# Altium schematic sheet fireAlarm.SchDoc
size 420 x 297 mm; SheetNumber: 1; SheetTotal: 1; DocumentName: Sheet1.SCHDOC
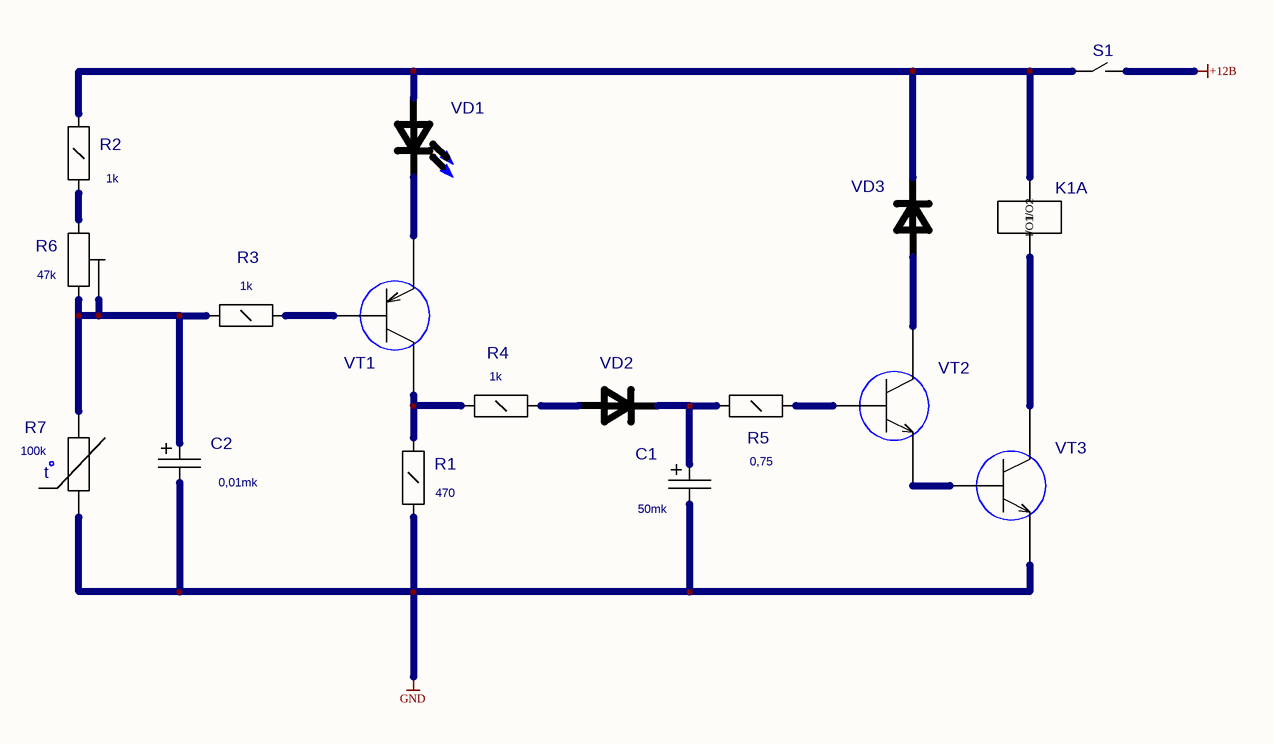
[diagram p0: fireAlarm.SchDoc]

## Parts
C1  value 50mk  [CE6032_C]  (hidden comment: CE6032-C)
C2  value 0,01mk  [CE6032_C]  (hidden comment: CE6032-C)
K1  РЭС-64  [RES64]  (value not drawn)  (part A of 2)
R1  value 470  [C2-33H-0.25W]  (hidden comment: C2-33H-0.25W_OLD_UGO)
R2  value 1k  [C2-33H-0.25W]  (hidden comment: C2-33H-0.25W_OLD_UGO)
R3  value 1k  [C2-33H-0.25W]  (hidden comment: C2-33H-0.25W_OLD_UGO)
R4  value 1k  [C2-33H-0.25W]  (hidden comment: C2-33H-0.25W_OLD_UGO)
R5  value 0,75  [C2-33H-0.25W]  (hidden comment: C2-33H-0.25W_OLD_UGO)
R6  value 47k  [3006P]  (hidden comment: 3006W)
R7  value 100k  [PTC-3]  (hidden comment: PTC-3)
S1  8AS9M2RE  [8AS9M2RE]  (value not drawn)
VD1  АЛ307КМ  [LED-5MM]  (value not drawn)
VD2  КД522А  [КД521(522)]  (value not drawn)
VD3  КД503А  [КД503А]  (value not drawn)
VT1  КТ3107Е  [TO-92-4]  (value not drawn)
VT2  КТ312  [КТ312]  (value not drawn)
VT3  КТ608Б  [КТ605]  (value not drawn)

## Nets
+12B: S1.1
GND: C1.2 C2.2 R1.1 R7.1 VT3.2(E)
NetC1_1: C1.1 R5.2 VD2.2(K)
NetC2_1: C2.1 R3.2 R6.2 R6.3 R7.2
NetK1_1: K1.1(I/O1) VT3.3(K)
NetK1_2: K1.2(I/O2) R2.2 S1.2 VD1.1(A) VD3.K
NetR1_2: R1.2 R4.2 VT1.E
NetR2_1: R2.1 R6.1
NetR3_1: R3.1 VT1.B
NetR4_1: R4.1 VD2.1(A)
NetR5_1: R5.1 VT2.B
NetVD1_2: VD1.2(K) VT1.C
NetVD3_A: VD3.A VT2.K
NetVT2_E: VT2.E VT3.1(B)

Not connected (* = marked no-connect by the designer): K1 5

## Notes on the sheet
- (in symbol PTC-3) t

## Library data of the parts
R1-R5 = C2-33H-0.25W_OLD_UGO: Autor: pcbdesigner.ru
K1 = РЭС-64: Value: *
R7 = PTC-3: Author: pcbdesigner.ru
S1 = 8AS9M2RE: Value: *; Author: pcbdesigner.ru
VD2 = КД522А: Value: *
VD3 = КД503А: Value: *
VT1 = КТ3107Е: Value: *
VT2 = КТ312: Value: *
VT3 = КТ608Б: Value: *